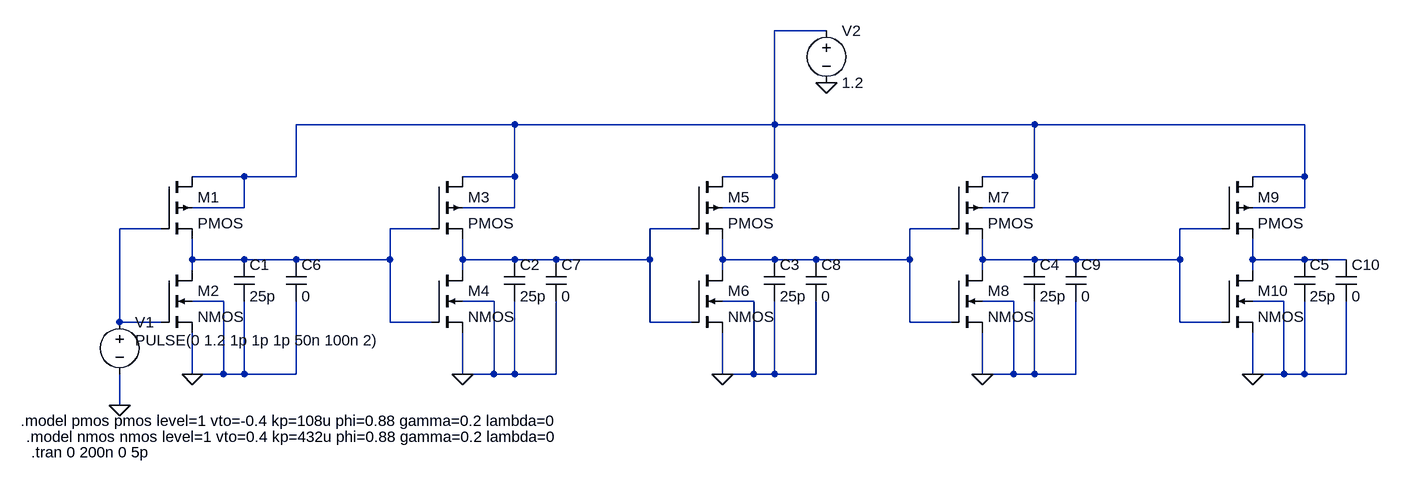
[diagram p0: schematic Lab03Pt6.asc]
Lab03Pt6.asc, the LTspice schematic file:
Version 4
SHEET 1 2056 680
WIRE 1168 -256 1088 -256
WIRE 688 -112 352 -112
WIRE 1088 -112 1088 -256
WIRE 1088 -112 688 -112
WIRE 1488 -112 1088 -112
WIRE 1904 -112 1488 -112
WIRE 272 -32 192 -32
WIRE 352 -32 352 -112
WIRE 352 -32 272 -32
WIRE 688 -32 688 -112
WIRE 688 -32 608 -32
WIRE 1088 -32 1088 -112
WIRE 1088 -32 1008 -32
WIRE 1488 -32 1488 -112
WIRE 1488 -32 1408 -32
WIRE 1904 -32 1904 -112
WIRE 1904 -32 1824 -32
WIRE 272 16 272 -32
WIRE 272 16 192 16
WIRE 688 16 688 -32
WIRE 688 16 608 16
WIRE 1088 16 1088 -32
WIRE 1088 16 1008 16
WIRE 1488 16 1488 -32
WIRE 1488 16 1408 16
WIRE 1904 16 1904 -32
WIRE 1904 16 1824 16
WIRE 144 48 80 48
WIRE 560 48 496 48
WIRE 960 48 896 48
WIRE 1360 48 1296 48
WIRE 1776 48 1712 48
WIRE 192 96 192 64
WIRE 272 96 192 96
WIRE 352 96 272 96
WIRE 496 96 496 48
WIRE 496 96 352 96
WIRE 608 96 608 64
WIRE 688 96 608 96
WIRE 752 96 688 96
WIRE 896 96 896 48
WIRE 896 96 752 96
WIRE 1008 96 1008 64
WIRE 1088 96 1008 96
WIRE 1152 96 1088 96
WIRE 1296 96 1296 48
WIRE 1296 96 1152 96
WIRE 1408 96 1408 64
WIRE 1488 96 1408 96
WIRE 1552 96 1488 96
WIRE 1712 96 1712 48
WIRE 1712 96 1552 96
WIRE 1824 96 1824 64
WIRE 1904 96 1824 96
WIRE 1968 96 1904 96
WIRE 192 112 192 96
WIRE 608 112 608 96
WIRE 1008 112 1008 96
WIRE 1408 112 1408 96
WIRE 1824 112 1824 96
WIRE 240 160 192 160
WIRE 656 160 608 160
WIRE 1056 160 1008 160
WIRE 1456 160 1408 160
WIRE 1872 160 1824 160
WIRE 80 192 80 48
WIRE 144 192 80 192
WIRE 496 192 496 96
WIRE 560 192 496 192
WIRE 896 192 896 96
WIRE 960 192 896 192
WIRE 1296 192 1296 96
WIRE 1360 192 1296 192
WIRE 1712 192 1712 96
WIRE 1776 192 1712 192
WIRE 192 272 192 208
WIRE 240 272 240 160
WIRE 240 272 192 272
WIRE 272 272 272 160
WIRE 272 272 240 272
WIRE 352 272 352 160
WIRE 352 272 272 272
WIRE 608 272 608 208
WIRE 656 272 656 160
WIRE 656 272 608 272
WIRE 688 272 688 160
WIRE 688 272 656 272
WIRE 752 272 752 160
WIRE 752 272 688 272
WIRE 1008 272 1008 208
WIRE 1056 272 1056 160
WIRE 1056 272 1008 272
WIRE 1088 272 1088 160
WIRE 1088 272 1056 272
WIRE 1152 272 1152 160
WIRE 1152 272 1088 272
WIRE 1408 272 1408 208
WIRE 1456 272 1456 160
WIRE 1456 272 1408 272
WIRE 1488 272 1488 160
WIRE 1488 272 1456 272
WIRE 1552 272 1552 160
WIRE 1552 272 1488 272
WIRE 1824 272 1824 208
WIRE 1872 272 1872 160
WIRE 1872 272 1824 272
WIRE 1904 272 1904 160
WIRE 1904 272 1872 272
WIRE 1968 272 1968 160
WIRE 1968 272 1904 272
WIRE 80 320 80 272
FLAG 192 272 0
FLAG 608 272 0
FLAG 1008 272 0
FLAG 1408 272 0
FLAG 1824 272 0
FLAG 1168 -176 0
FLAG 80 320 0
SYMBOL voltage 80 176 R0
WINDOW 123 0 0 Left 0
WINDOW 39 0 0 Left 0
WINDOW 3 24 44 Left 2
SYMATTR Value PULSE(0 1.2 1p 1p 1p 50n 100n 2)
SYMATTR InstName V1
SYMBOL pmos4 144 -32 R0
SYMATTR InstName M1
SYMATTR Value2 l=0.1u w=8u
SYMBOL nmos4 144 112 R0
SYMATTR InstName M2
SYMATTR Value2 l=0.1u w=2u
SYMBOL cap 256 96 R0
SYMATTR InstName C1
SYMATTR Value 25p
SYMBOL pmos4 560 -32 R0
SYMATTR InstName M3
SYMATTR Value2 l=0.1u w=8u
SYMBOL nmos4 560 112 R0
SYMATTR InstName M4
SYMATTR Value2 l=0.1u w=2u
SYMBOL cap 672 96 R0
SYMATTR InstName C2
SYMATTR Value 25p
SYMBOL pmos4 960 -32 R0
SYMATTR InstName M5
SYMATTR Value2 l=0.1u w=16u
SYMBOL nmos4 960 112 R0
SYMATTR InstName M6
SYMATTR Value2 l=0.1u w=2u
SYMBOL cap 1072 96 R0
SYMATTR InstName C3
SYMATTR Value 25p
SYMBOL pmos4 1360 -32 R0
SYMATTR InstName M7
SYMATTR Value2 l=0.1u w=8u
SYMBOL nmos4 1360 112 R0
SYMATTR InstName M8
SYMATTR Value2 l=0.1u w=2u
SYMBOL cap 1472 96 R0
SYMATTR InstName C4
SYMATTR Value 25p
SYMBOL pmos4 1776 -32 R0
SYMATTR InstName M9
SYMATTR Value2 l=0.1u w=8u
SYMBOL nmos4 1776 112 R0
SYMATTR InstName M10
SYMATTR Value2 l=0.1u w=2u
SYMBOL cap 1888 96 R0
SYMATTR InstName C5
SYMATTR Value 25p
SYMBOL voltage 1168 -272 R0
WINDOW 123 0 0 Left 0
WINDOW 39 0 0 Left 0
SYMATTR InstName V2
SYMATTR Value 1.2
SYMBOL cap 336 96 R0
SYMATTR InstName C6
SYMATTR Value 0
SYMBOL cap 736 96 R0
SYMATTR InstName C7
SYMATTR Value 0
SYMBOL cap 1136 96 R0
SYMATTR InstName C8
SYMATTR Value 0
SYMBOL cap 1536 96 R0
SYMATTR InstName C9
SYMATTR Value 0
SYMBOL cap 1952 96 R0
SYMATTR InstName C10
SYMATTR Value 0
TEXT -64 368 Left 2 !.model nmos nmos level=1 vto=0.4 kp=432u phi=0.88 gamma=0.2 lambda=0
TEXT -72 344 Left 2 !.model pmos pmos level=1 vto=-0.4 kp=108u phi=0.88 gamma=0.2 lambda=0
TEXT -56 392 Left 2 !.tran 0 200n 0 5p

The netlist it stands for:
* Lab03Pt6.asc
V1 N002 0 PULSE(0 1.2 1p 1p 1p 50n 100n 2)
M1 N001 N002 N003 N001 PMOS l=0.1u w=8u
M2 N003 N002 0 0 NMOS l=0.1u w=2u
C1 N003 0 25p
M3 N001 N003 N004 N001 PMOS l=0.1u w=8u
M4 N004 N003 0 0 NMOS l=0.1u w=2u
C2 N004 0 25p
M5 N001 N004 N005 N001 PMOS l=0.1u w=16u
M6 N005 N004 0 0 NMOS l=0.1u w=2u
C3 N005 0 25p
M7 N001 N005 N006 N001 PMOS l=0.1u w=8u
M8 N006 N005 0 0 NMOS l=0.1u w=2u
C4 N006 0 25p
M9 N001 N006 N007 N001 PMOS l=0.1u w=8u
M10 N007 N006 0 0 NMOS l=0.1u w=2u
C5 N007 0 25p
V2 N001 0 1.2
C6 N003 0 0
C7 N004 0 0
C8 N005 0 0
C9 N006 0 0
C10 N007 0 0
.model NMOS NMOS
.model PMOS PMOS
.lib standard.mos
.model nmos nmos level=1 vto=0.4 kp=432u phi=0.88 gamma=0.2 lambda=0
.model pmos pmos level=1 vto=-0.4 kp=108u phi=0.88 gamma=0.2 lambda=0
.tran 0 200n 0 5p
.backanno
.end